# Altium schematic sheet Video out.SchDoc
size A3
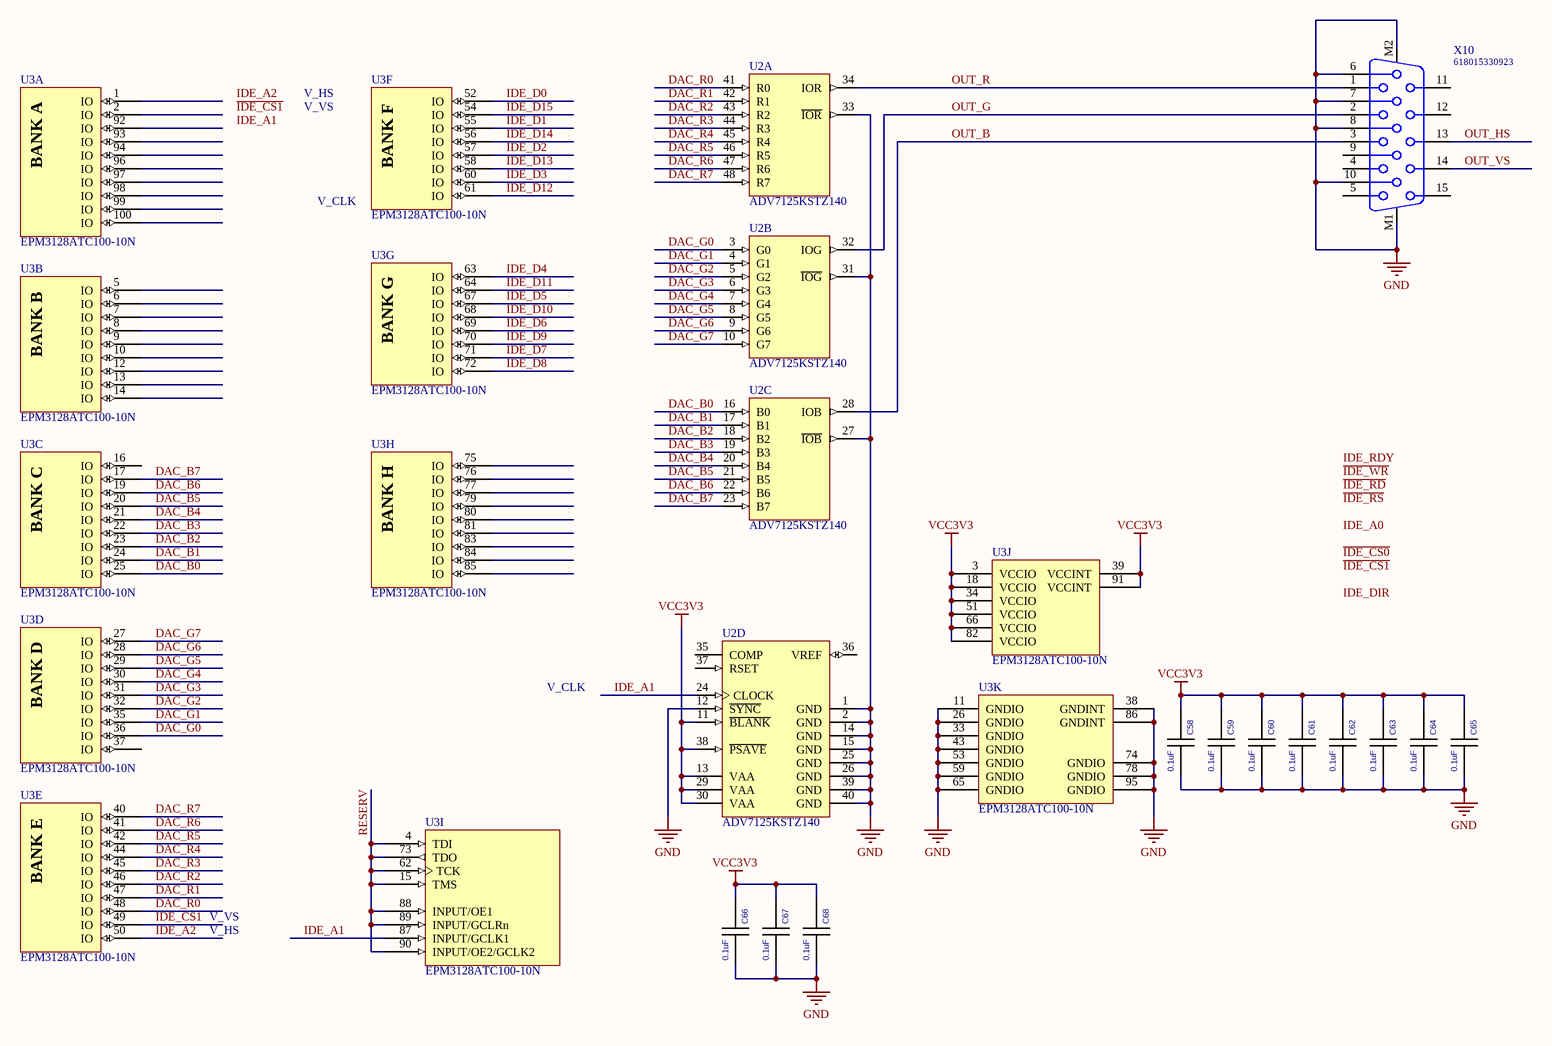
[diagram p0: Video out.SchDoc]

## Parts
C58  value 0.1uF  [C-CHIP]  (hidden comment: CAPCHIP)
C59  value 0.1uF  [C-CHIP]  (hidden comment: CAPCHIP)
C60  value 0.1uF  [C-CHIP]  (hidden comment: CAPCHIP)
C61  value 0.1uF  [C-CHIP]  (hidden comment: CAPCHIP)
C62  value 0.1uF  [C-CHIP]  (hidden comment: CAPCHIP)
C63  value 0.1uF  [C-CHIP]  (hidden comment: CAPCHIP)
C64  value 0.1uF  [C-CHIP]  (hidden comment: CAPCHIP)
C65  value 0.1uF  [C-CHIP]  (hidden comment: CAPCHIP)
C66  value 0.1uF  [C-CHIP]  (hidden comment: CAPCHIP)
C67  value 0.1uF  [C-CHIP]  (hidden comment: CAPCHIP)
C68  value 0.1uF  [C-CHIP]  (hidden comment: CAPCHIP)
U2  ADV7125KSTZ140  [ST-48_N]  (parts A,B,C,D of 4)
U3  EPM3128ATC100-10N  [ALTR-TQFP100_A-120_D1-140_L]  (parts A,B,C,D,E,F,G,H,I,J,K of 11)
X10  618015330923  [618015330923]

## Nets
GND: C58.2 C59.2 C60.2 C61.2 C62.2 C63.2 C64.2 C65.2 C66.2 C67.2 C68.2 U2.1(GND) U2.2(GND) U2.12(~{SYNC}) U2.14(GND) U2.15(GND) U2.25(GND) U2.26(GND) U2.27(~{IOB}) U2.31(~{IOG}) U2.33(~{IOR}) U2.39(GND) U2.40(GND) U3.11(GNDIO) U3.26(GNDIO) U3.33(GNDIO) U3.38(GNDINT) U3.43(GNDIO) U3.53(GNDIO) U3.59(GNDIO) U3.65(GNDIO) U3.74(GNDIO) U3.78(GNDIO) U3.86(GNDINT) U3.95(GNDIO) X10.6 X10.7 X10.8 X10.10 X10.M1 X10.M2
VCC3V3: C58.1 C59.1 C60.1 C61.1 C62.1 C63.1 C64.1 C65.1 C66.1 C67.1 C68.1 U2.11(~{BLANK}) U2.13(VAA) U2.29(VAA) U2.30(VAA) U2.38(~{PSAVE}) U3.3(VCCIO) U3.18(VCCIO) U3.34(VCCIO) U3.39(VCCINT) U3.51(VCCIO) U3.66(VCCIO) U3.82(VCCIO) U3.91(VCCINT)
DAC_B0: U2.16(B0) U3.25(IO)
DAC_B1: U2.17(B1) U3.24(IO)
DAC_B2: U2.18(B2) U3.23(IO)
DAC_B3: U2.19(B3) U3.22(IO)
DAC_B4: U2.20(B4) U3.21(IO)
DAC_B5: U2.21(B5) U3.20(IO)
DAC_B6: U2.22(B6) U3.19(IO)
DAC_B7: U2.23(B7) U3.17(IO)
DAC_G0: U2.3(G0) U3.36(IO)
DAC_G1: U2.4(G1) U3.35(IO)
DAC_G2: U2.5(G2) U3.32(IO)
DAC_G3: U2.6(G3) U3.31(IO)
DAC_G4: U2.7(G4) U3.30(IO)
DAC_G5: U2.8(G5) U3.29(IO)
DAC_G6: U2.9(G6) U3.28(IO)
DAC_G7: U2.10(G7) U3.27(IO)
DAC_R0: U2.41(R0) U3.48(IO)
DAC_R1: U2.42(R1) U3.47(IO)
DAC_R2: U2.43(R2) U3.46(IO)
DAC_R3: U2.44(R3) U3.45(IO)
DAC_R4: U2.45(R4) U3.44(IO)
DAC_R5: U2.46(R5) U3.42(IO)
DAC_R6: U2.47(R6) U3.41(IO)
DAC_R7: U2.48(R7) U3.40(IO)
~{IDE_CS1}: U3.49(IO)
IDE_A1: U2.24(CLOCK) U3.87(INPUT/GCLK1)
IDE_A2: U3.50(IO)
IDE_D0: U3.52(IO)
IDE_D1: U3.55(IO)
IDE_D2: U3.57(IO)
IDE_D3: U3.60(IO)
IDE_D4: U3.63(IO)
IDE_D5: U3.67(IO)
IDE_D6: U3.69(IO)
IDE_D7: U3.71(IO)
IDE_D8: U3.72(IO)
IDE_D9: U3.70(IO)
IDE_D10: U3.68(IO)
IDE_D11: U3.64(IO)
IDE_D12: U3.61(IO)
IDE_D13: U3.58(IO)
IDE_D14: U3.56(IO)
IDE_D15: U3.54(IO)
OUT_B: U2.28(IOB) X10.3
OUT_G: U2.32(IOG) X10.2
OUT_HS: X10.13
OUT_R: U2.34(IOR) X10.1
OUT_VS: X10.14
RESERV: U3.4(TDI) U3.15(TMS) U3.62(TCK) U3.73(TDO) U3.88(INPUT/OE1) U3.89(INPUT/GCLRn) U3.90(INPUT/OE2/GCLK2)

Not connected (* = marked no-connect by the designer): U2 35(COMP) 36(VREF) 37(RSET); U3 1(IO) 2(IO) 5(IO) 6(IO) 7(IO) 8(IO) 9(IO) 10(IO) 12(IO) 13(IO) 14(IO) 16(IO) 37(IO) 75(IO) 76(IO) 77(IO) 79(IO) 80(IO) 81(IO) 83(IO) 84(IO) 85(IO) 92(IO) 93(IO) 94(IO) 96(IO) 97(IO) 98(IO) 99(IO) 100(IO); X10 4 5 9 11 12 15

## Notes on the sheet
- V_HS
- V_VS
- V_CLK
- Labels drawn without touching a wire or pin: IDE_A0, IDE_A1, IDE_A2, IDE_DIR, IDE_RDY, ~{IDE_CS0}, ~{IDE_CS1}, ~{IDE_RD}, ~{IDE_RS}, ~{IDE_WR}
- (in symbol CMP-2000-06227-1, part A) BANK A
- (in symbol CMP-2000-06227-1, part B) BANK B
- (in symbol CMP-2000-06227-1, part C) BANK C
- (in symbol CMP-2000-06227-1, part D) BANK D
- (in symbol CMP-2000-06227-1, part E) BANK E
- (in symbol CMP-2000-06227-1, part F) BANK F
- (in symbol CMP-2000-06227-1, part G) BANK G
- (in symbol CMP-2000-06227-1, part H) BANK H

## Library data of the parts
U2 = CMP-0318-00718-2: 3 Channel 8-Bit CMOS High Speed Video Digital-to-Analog Converter, -40 to +85 degC, ST-48, Pb-Free, Tray; Manufacturer: Analog Devices; Max V+: 5.25V; Op Pwr Diss: 485mW; Resolution (Bits): 8; # DAC Outputs: 3; Single Supply: No; ComponentLink3URL: http://www.analog.com/static/imported-files/packages/PKG_PDF/LQFP%28ST%29/ST_48.pdf; PackageDescription: 48-Pin Thin Quad Flat Pack 0.5 mm Pitch; Generic Part Number: ADV7125; ComponentLink2Description: Datasheet; ComponentLink1URL: http://www.analog.com/en/index.html; ComponentLink2URL: http://www.analog.com/static/imported-files/data_sheets/ADV7125.pdf; ComponentLink3Description: Package Specification; Packing: Tray; PartNumber: ADV7125KSTZ140; DatasheetVersion: Rev.C; PackageVersion: revA; ComponentLink4Description: Product URL; PackageReference: ST-48; ComponentLink4URL: http://www.analog.com/en/digital-to-analog-converters/da-converters/adv7125/products/product.html; RevisionNote: Component URL fixed; ComponentLink1Description: Manufacturer URL; RoHS: Y; Mounting Technology: Surface Mount
U3 = CMP-2000-06227-1: MAX(R) 3000A CPLD, 80 I/Os, Speed Grade 5, Commercial Grade, 100-Pin TQFP, RoHS; Manufacturer: Altera; Frequency: 98MHz; CPLD Type: EEPROM; No. of Pins: 100; Supply Voltage Max: 3.6V; No. of I/O's: 80; IC Generic Number: 3128; Supply Voltage: 3.3V; Propagation Delay: 10ns; Supply Voltage Range: 3Vto3.6V; Logic IC Function: PLD; I/O Interface Standard: CMOS,TTL; Global Clock Setup Time: 6.6ns; No. of Macrocells: 128; Package Version: Rev. 16.8, 12/2011; No. of Gates: 2500; Supply Voltage Min: 3V; SVHC: NoSVHC(19-Dec-2011); Operating Temperature Min: 0°C; Series: MAX3000A; Package / Case: TQFP; Logic Case Style: TQFP; Manufacturer URL: https://www.altera.com/; Logic Function Number: 3128; Datasheet Version: Rev. 3.5, 06/2006; Package Description: 100-Pin Plastic Thin Quad Flat Pack (TQFP), Body 14 x 14 mm, Pitch 0.5 mm; Package URL: https://www.altera.com/content/dam/altera-www/global/en_US/pdfs/literature/ds/pkgds.pdf#page=67-68; No. of Inputs: 80; Package Reference: TQFP100_A-120_D1-140; Mounting Technology: SurfaceMount; Programmable Logic Type: PLD; MSL: MSL3-168hours; Datasheet URL: https://www.altera.com/content/dam/altera-www/global/en_US/pdfs/literature/ds/ds_m3000a.pdf; Operating Temperature Max: 70°C; Logic IC Base Number: 3128; Termination Type: SMD; Operating Temperature Range: 0°Cto+70°C; Base Number: 3128
X10 = CMP-1502-00216-1: Female High Density PCB Connector with Hex Screw WR-DSUB, Angled, 15 pins; Manufacturer: Wurth Elektronik; Contact Resistance: 30mOhm; Rated Current: 3A; Working Voltage: 60VAC; Pin Number: 15; Datasheet URL: https://katalog.we-online.de/em/datasheet/6180xx330923.pdf; Packaging: Tray; Operating Temperature: -40to85degC; Manufacturer URL: http://www.we-online.de; Mounting Technology: THT; Part Number: 618015330923; Gender: Female; Publisher: WurthElektronik; Orientation: Angled; Package Reference: 618015330923